# EAGLE design Arduino Advanced Sensor Board (EAGLE 7.5.0)
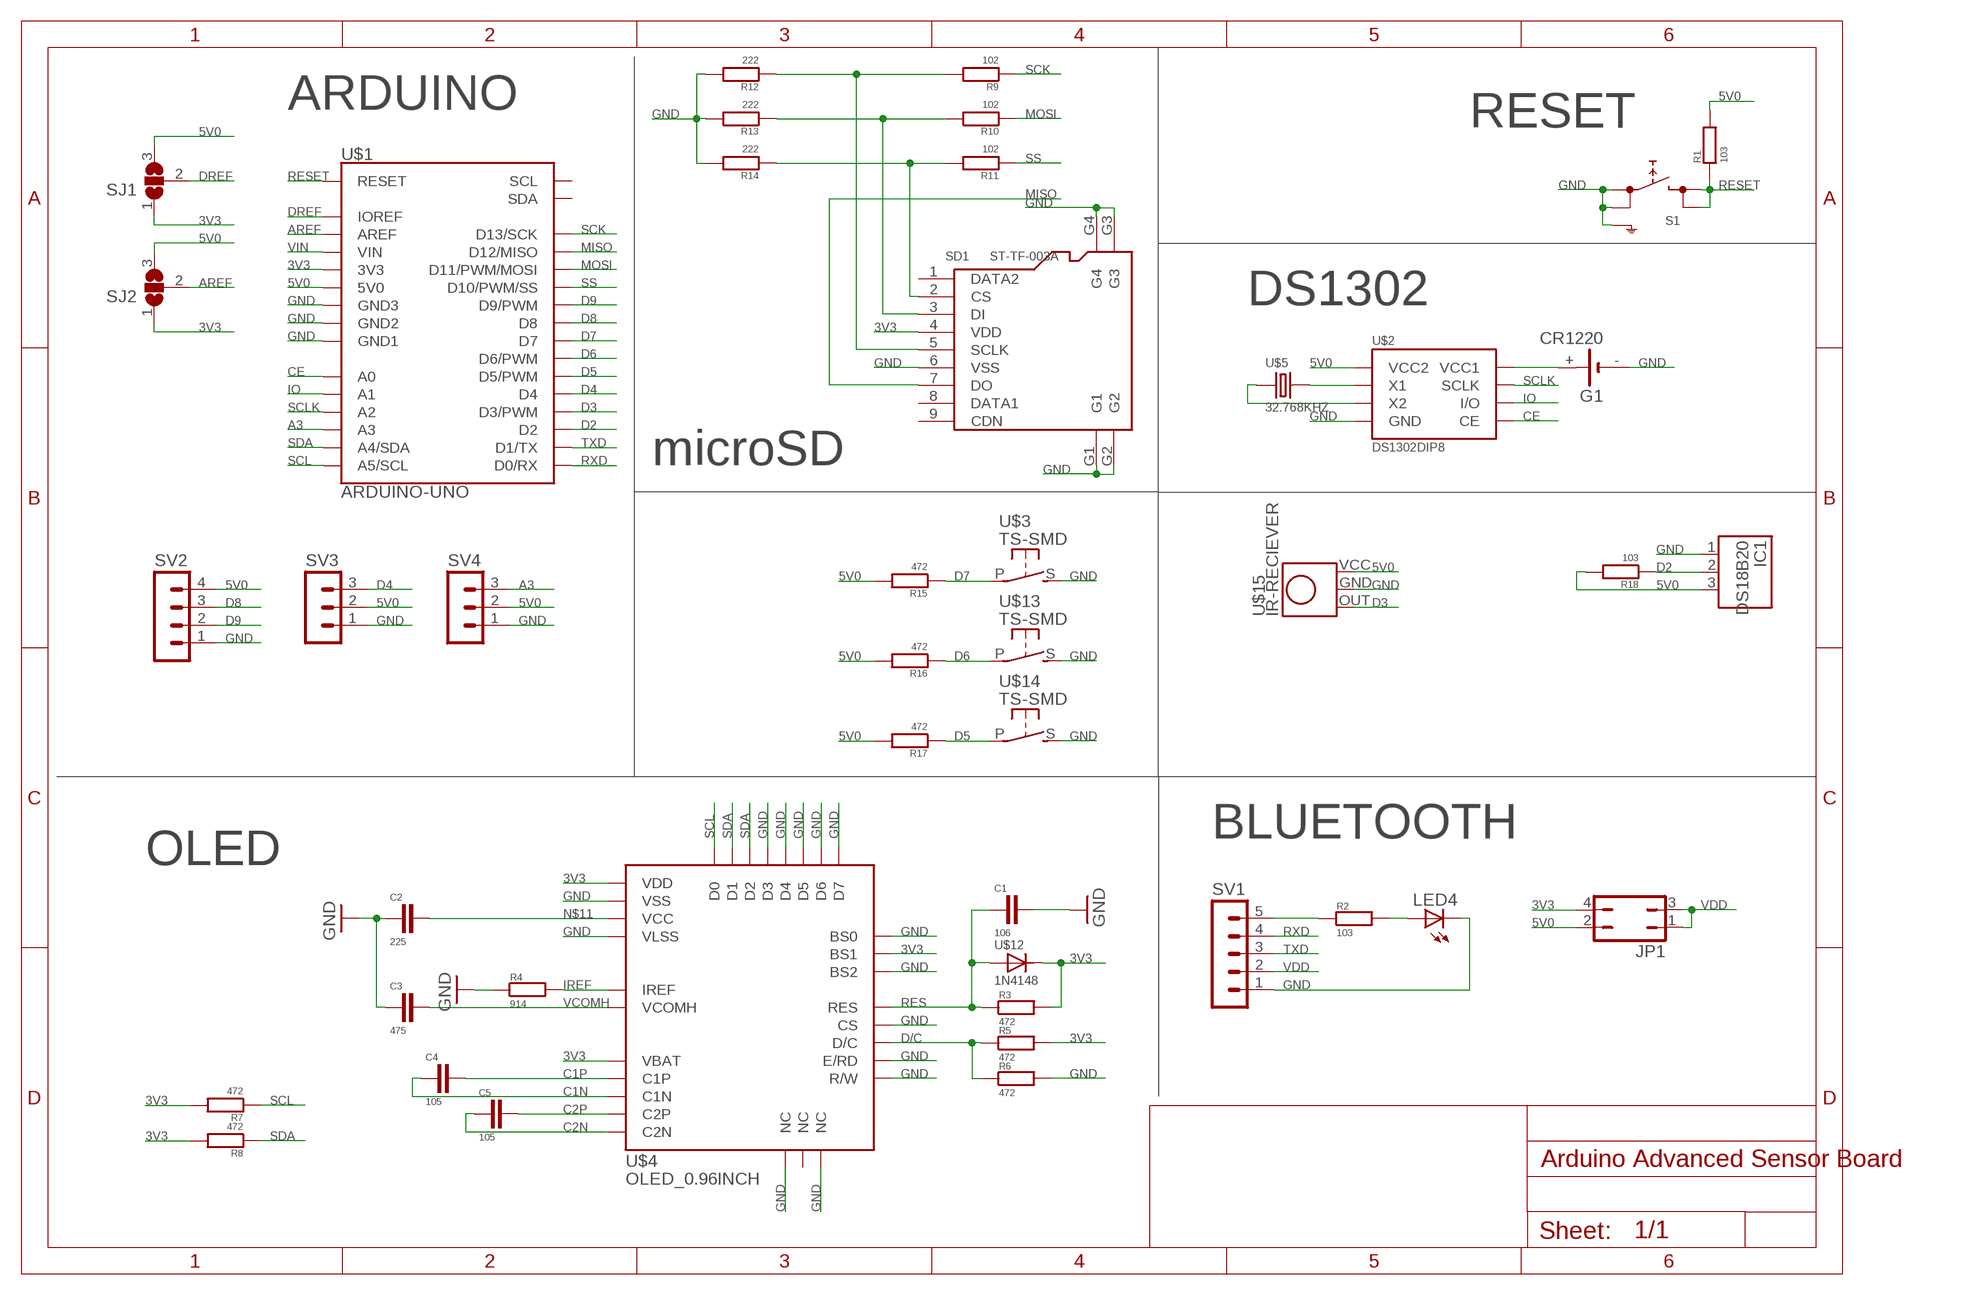
[diagram p0: schematic, sheet 1]

## Parts
C1  106  C0805  [C0805]
C2  225  C0805  [C0805]
C3  475  C0805  [C0805]
C4  105  C0805  [C0805]
C5  105  C0805  [C0805]
G1  CR1220  [CR1220]
IC1  DS18B20  [TO92]
JP1  JP2Q  [JP2Q]
LED4  LEDCHIPLED_0805  [LED0805]
R1  103  R0805  [R0805]
R2  103  R0805  [R0805]
R3  472  R0805  [R0805]
R4  914  R0805  [R0805]
R5  472  R0805  [R0805]
R6  472  R0805  [R0805]
R7  472  R0805  [R0805]
R8  472  R0805  [R0805]
R9  102  R0805  [R0805]
R10  102  R0805  [R0805]
R11  102  R0805  [R0805]
R12  222  R0805  [R0805]
R13  222  R0805  [R0805]
R14  222  R0805  [R0805]
R15  472  R0805  [R0805]
R16  472  R0805  [R0805]
R17  472  R0805  [R0805]
R18  103  R0805  [R0805]
S1  TS-SMD_6S6_SHIELD  [TS-SMD_6*6_SHIELD]
SD1  ST-TF-003A  MICRO-SD-SMD-9+4  [MICRO-SD-SMD-9+4]
SJ1  SJ2W  [SJ_2]
SJ2  SJ2W  [SJ_2]
SV1  MA05-1  [MA05-1]
SV2  MA04-1  [MA04-1]
SV3  MA03-1  [MA03-1]
SV4  MA03-1  [MA03-1]
U$1  ARDUINO-UNO  [ARDUINO-UNO]
U$2  DS1302DIP8  [DIP8]
U$3  TS-SMD  [TS-SMD]
U$4  OLED_0.96INCH  [OLED_0.96INCH]
U$5  32.768KHZ  [32.768KHZ]
U$12  1N4148  [SOD123]
U$13  TS-SMD  [TS-SMD]
U$14  TS-SMD  [TS-SMD]
U$15  IR-RECIEVER  [IR-RECIEVER]

## Nets
3V3: JP1.4 R3.2 R5.2 R7.2 R8.2 SD1.4(VDD) SJ1.1 SJ2.1 U$1.3V3 U$4.6(VBAT) U$4.9(VDD) U$4.11(BS1) U$12.1
5V0: IC1.3(VCC) JP1.2 R1.2 R15.2 R16.2 R17.2 R18.2 SJ1.3 SJ2.3 SV2.4 SV3.2 SV4.2 U$1.5V0 U$2.1(VCC2) U$15.VCC
A3: SV4.3 U$1.A3
AREF: SJ2.2 U$1.AREF
C1N: C4.2 U$4.5(C1N)
C1P: C4.1 U$4.4(C1P)
C2N: C5.2 U$4.3(C2N)
C2P: C5.1 U$4.2(C2P)
CE: U$1.A0 U$2.5(CE)
D2: IC1.2(DQ) R18.1 U$1.D2
D3: U$1.D3(D3/PWM) U$15.OUT
D4: SV3.3 U$1.D4
D5: R17.1 U$1.D5(D5/PWM) U$14.P
D6: R16.1 U$1.D6(D6/PWM) U$13.P
D7: R15.1 U$1.D7 U$3.P
D8: SV2.3 U$1.D8
D9: SV2.2 U$1.D9(D9/PWM)
D/C: R5.1 R6.1 U$4.15(D/C)
DREF: SJ1.2 U$1.REF(IOREF)
GND: C1.1 C2.2 C3.2 G1.- IC1.1(GND) LED4.C R4.1 R6.2 R12.2 R13.2 R14.2 S1.1(1.1) S1.2(1.2) S1.5(SH) SD1.6(VSS) SD1.G1 SD1.G2 SD1.G3 SD1.G4 SV1.1 SV2.1 SV3.1 SV4.1 U$1.GND1 U$1.GND2 U$1.GND3 U$2.4(GND) U$3.S U$4.1(NC) U$4.8(VSS) U$4.10(BS0) U$4.12(BS2) U$4.13(CS) U$4.16(R/W) U$4.17(E/RD) U$4.21(D3) U$4.22(D4) U$4.23(D5) U$4.24(D6) U$4.25(D7) U$4.29(VLSS) U$4.30(NC) U$13.S U$14.S U$15.GND
IO: U$1.A1 U$2.6(I/O)
IREF: R4.2 U$4.26(IREF)
MISO: SD1.7(DO) U$1.D12(D12/MISO)
MOSI: R10.1 U$1.D11(D11/PWM/MOSI)
N$4: U$2.2(X1) U$5.P$2
N$5: U$2.3(X2) U$5.P$1
N$6: G1.+ U$2.8(VCC1)
N$7: R2.1 SV1.5
N$8: LED4.A R2.2
N$9: R11.2 R14.1 SD1.2(CS)
N$10: R10.2 R13.1 SD1.3(DI)
N$11: C2.1 U$4.28(VCC)
N$12: R9.2 R12.1 SD1.5(SCLK)
RES: C1.2 R3.1 U$4.14(RES) U$12.2
RESET: R1.1 S1.3(2.1) S1.4(2.2) U$1.RST(RESET)
RXD: SV1.4 U$1.D0(D0/RX)
SCK: R9.1 U$1.D13(D13/SCK)
SCL: R7.1 U$1.A5(A5/SCL) U$4.18(D0)
SCLK: U$1.A2 U$2.7(SCLK)
SDA: R8.1 U$1.A4(A4/SDA) U$4.19(D1) U$4.20(D2)
SS: R11.1 U$1.D10(D10/PWM/SS)
TXD: SV1.3 U$1.D1(D1/TX)
VCOMH: C3.1 U$4.27(VCOMH)
VDD: JP1.1 JP1.3 SV1.2
VIN: U$1.VIN
Unconnected: SD1.1(DATA2) SD1.8(DATA1) SD1.9(CDN) U$1.SCL U$1.SDA U$4.7(NC)

## Notes on the sheet
- ARDUINO
- RESET
- DS1302
- microSD
- BLUETOOTH
- OLED

## Library data of the parts
C1-C5 = RCLDA:C: CAPACITOR
G1 = Power:CR1220: Battery Holder, SMT, 12mm multicomp PART NO. CH291-1220LF Source: Data sheet <http://www.farnell.com/datasheets/1505860.pdf>
IC1 = Senser:DS18B20: Programmable Resolution Digital Thermometer This chip provides a onewire thermosensor with approx. 0.5°C accuracy. A programmable over/undertemperure alarm is available. The precision can be set from 9..12 bits. Notes: Vdd must be applied for accurate measurements at low temperatures, as the parasite power circuit otherwise heats the sensor. If parasite power is used, Vdd has to be connected to GND. The DS1822 is a low-cost thermometer chip, the DS18S20 is similar to the DS18B20, but with 9 Bit precision only. Author: Jan Kandziora <jjj@gmx.de>
JP1 = Jumper:JP2Q: JUMPER
LED4 = Display:LED
R1-R18 = RCLDA:R: RESISTOR
S1 = Button:TS-SMD_6*6_SHIELD: 6.2 X 6.5mm TACT Switch (SMD) Source: http://www3.alps.co.jp/WebObjects/catalog.woa/PDF/E/Switch/Tact/SKHM/SKHM.PDF
SD1 = Socket:MICRO-SD-SMD-9+4: 320090000; MPN: ST-TF-003A
SJ1 SJ2 = Jumper:SJ2W: SMD solder JUMPER
SV1 = Pin-Header:MA05-1: PIN HEADER; OC_FARNELL: unknown; OC_NEWARK: unknown
SV2 = Pin-Header:MA04-1: PIN HEADER; OC_FARNELL: unknown; OC_NEWARK: unknown
SV3 SV4 = Pin-Header:MA03-1: PIN HEADER; OC_FARNELL: unknown; OC_NEWARK: unknown
U$1 = Module:ARDUINO-UNO
U$2 = Chip:DS1302
U$3 U$13 U$14 = Button:TS-SMD
U$4 = Display:OLED_0.96INCH
U$5 = Crystal:32.768KHZ
U$12 = RCLDA:1N4148
U$15 = Senser:IR-RECIEVER

## Board
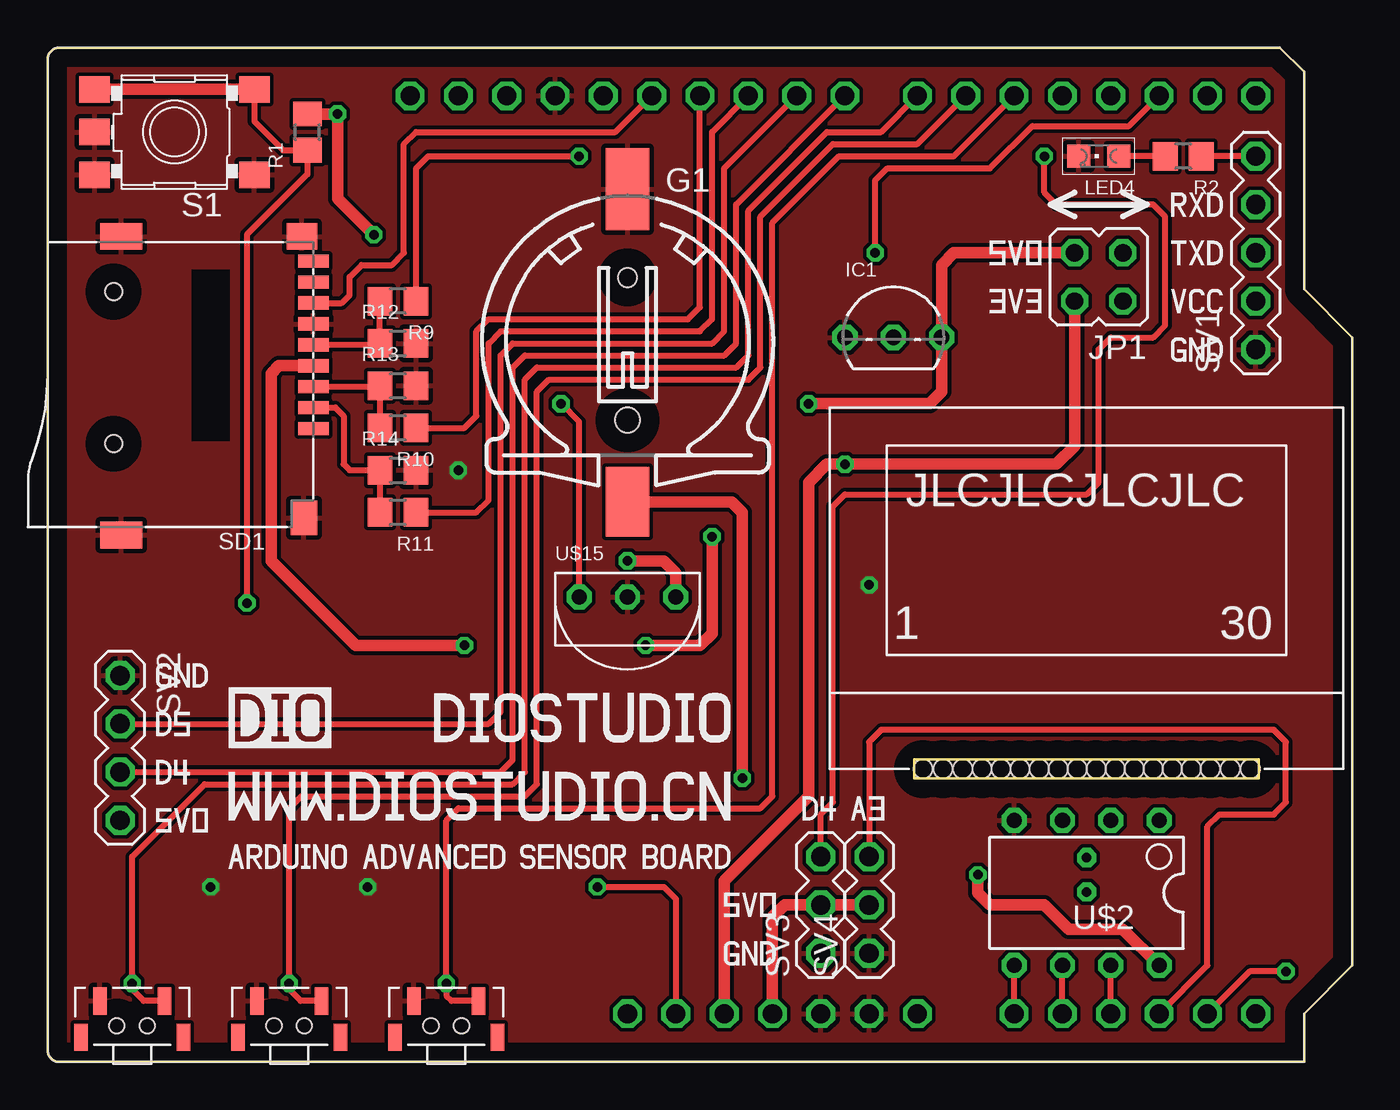
[diagram p1: board, top side]
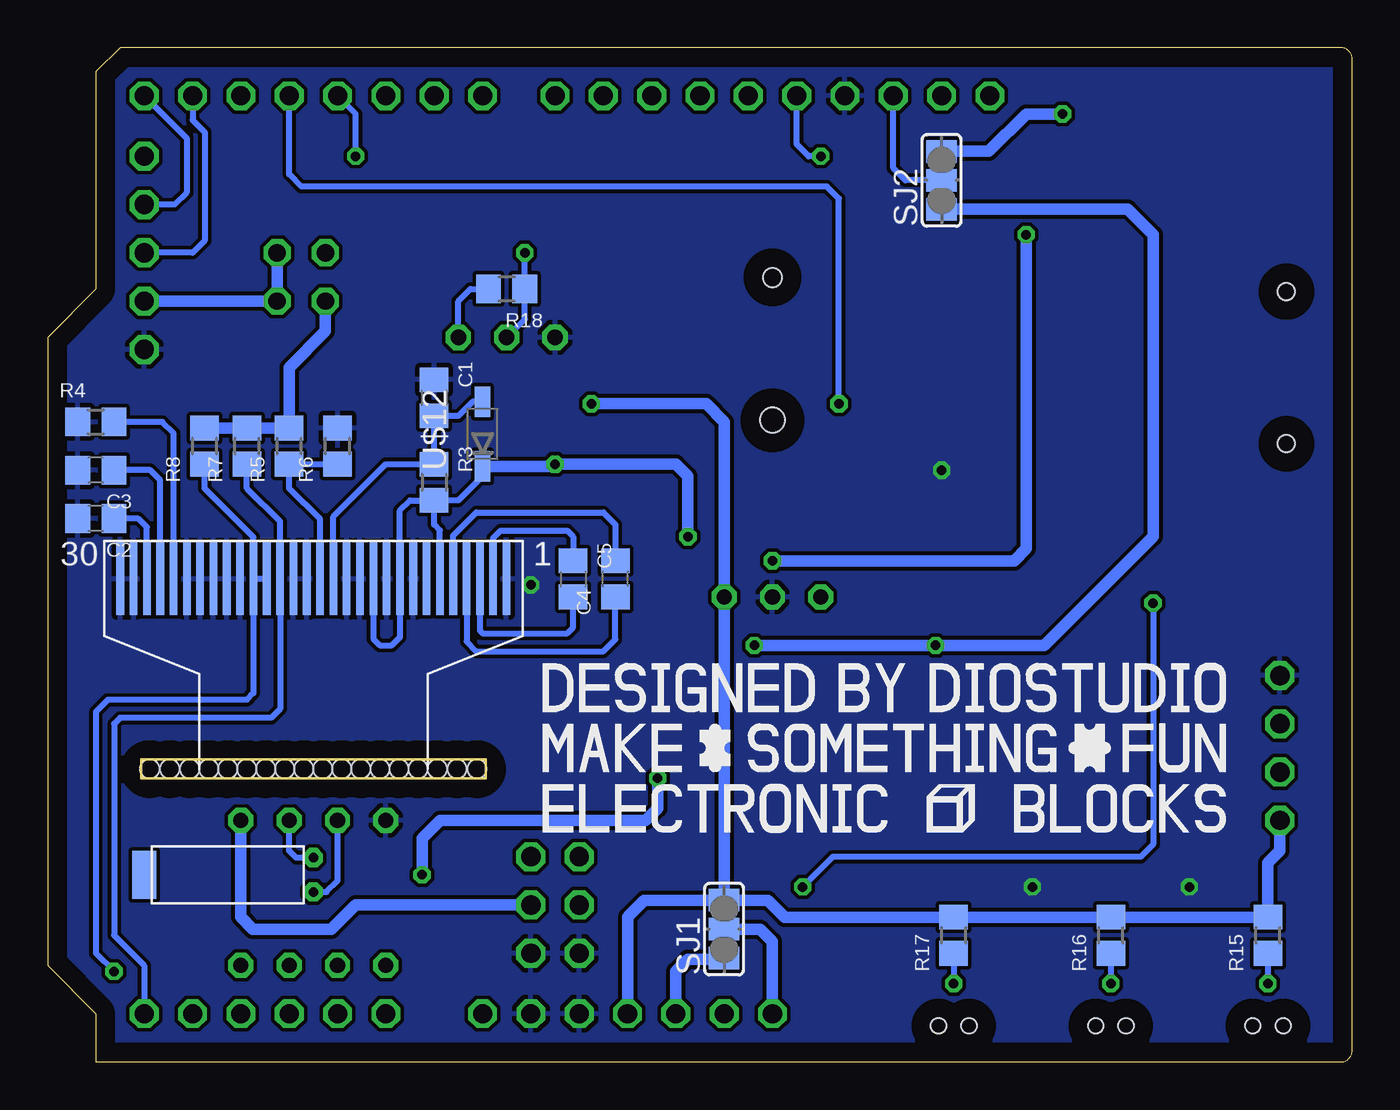
[diagram p2: board, bottom side, seen from below]

Size 68.58 x 53.34 mm. Coordinates in mm from the lower left corner, seen from the top.
Outline: 0,0.64 0,52.7 arc-90 0.64,53.34 64.77,53.34 66.04,52.07 66.04,40.64 68.58,38.1 68.58,5.08 66.04,2.54 66.04,0 0.64,0 arc-90 0,0.64
Copper layers (1*16): Top 0.035mm / dielectric 1.5mm / Bottom 0.035mm
Design rules "default": minimum track width 10mil, minimum drill 24mil, track to track 8mil, track to pad 8mil, pad to pad 8mil, via to via 8mil, smd to smd 8mil, copper to edge 40mil, drill to drill 8mil, minimum pad ring 10mil, minimum via ring 8mil, stop-mask expansion 4mil, vias tented up to drill 0mil, thermal gap 10mil

### Footprints (pad centres in the part's own frame; a part is rotated, then mirrored left to right if it is on the bottom)
C0805 = smd 1.3 x 1.5: 1 -0.95,0; 2 0.95,0
CR1220 = smd 2.3 x 3.66: + 0,-2.296 | smd 2.3 x 4.3: - 0,14.146 | hole 1.3: 0,2 | hole 1: 0,9.5
TO92 = drill 0.813 octagon: 1 -2.54,0; 2 0,0; 3 2.54,0
JP2Q = drill 0.914 octagon: 1 -1.27,-1.27; 2 1.27,-1.27; 3 -1.27,1.27; 4 1.27,1.27
LED0805 = smd 1.2 x 1.2: A -1.05,0; C 1.05,0
R0805 = smd 1.3 x 1.5: 1 -0.95,0; 2 0.95,0
TS-SMD_6*6_SHIELD = smd 1.6 x 1.4: 1 -4.2,2.25; 2 4.2,2.25; 3 -4.2,-2.25; 4 4.2,-2.25; 5 4.2,0
MICRO-SD-SMD-9+4 = smd 1.6 x 0.7: 1 0,2.25; 2 0,1.15; 3 0,0.05; 4 0,-1.05; 5 0,-2.15; 6 0,-3.25; 7 0,-4.35; 8 0,-5.45; 9 0,-6.55 | smd 1.6 x 1.4: G1 0.6,-7.85 | smd 2.2 x 1.4: G2 10.1,-7.85; G3 10.1,7.85 | smd 1.4 x 1.8: G4 0.5,6.95 | hole 0.9: 10.5,-4.95; 10.5,3.05
SJ_2 = smd 1.168 x 1.6: 1 -1.524,0; 2 0,0; 3 1.524,0
MA05-1 = drill 1.016 octagon: 1 -5.08,0; 2 -2.54,0; 3 0,0; 4 2.54,0; 5 5.08,0
MA04-1 = drill 1.016 octagon: 1 -3.81,0; 2 -1.27,0; 3 1.27,0; 4 3.81,0
MA03-1 = drill 1.016 octagon: 1 -2.54,0; 2 0,0; 3 2.54,0
ARDUINO-UNO = drill 1 octagon: 3V3 35.56,2.54; 5V0 38.1,2.54; A0 50.8,2.54; A1 53.34,2.54; A2 55.88,2.54; A3 58.42,2.54; A4 60.96,2.54; A5 63.5,2.54; AREF 24.13,50.8; D0 63.5,50.8; D1 60.96,50.8; D2 58.42,50.8; D3 55.88,50.8; D4 53.34,50.8; D5 50.8,50.8; D6 48.26,50.8; D7 45.72,50.8; D8 41.91,50.8; D9 39.37,50.8; D10 36.83,50.8; D11 34.29,50.8; D12 31.75,50.8; D13 29.21,50.8; GND1 26.67,50.8; GND2 43.18,2.54; GND3 40.64,2.54; REF 30.48,2.54; RST 33.02,2.54; SCL 19.05,50.8; SDA 21.59,50.8; VIN 45.72,2.54
DIP8 = drill 0.8 octagon: 1 -3.81,-3.81; 2 -1.27,-3.81; 3 1.27,-3.81; 4 3.81,-3.81; 5 3.81,3.81; 6 1.27,3.81; 7 -1.27,3.81; 8 -3.81,3.81
TS-SMD = smd 0.711 x 1.422: P -1.7,-1.3; P$1 2.7,0.6; P$4 -2.7,0.6; S 1.7,-1.3 | hole 0.8: 0.8,0; -0.8,0
OLED_0.96INCH = smd 0.4 x 3.81 bottom: 1 -10.15,0; 2 -9.45,0; 3 -8.75,0; 4 -8.05,0; 5 -7.35,0; 6 -6.65,0; 7 -5.95,0; 8 -5.25,0; 9 -4.55,0; 10 -3.85,0; 11 -3.15,0; 12 -2.45,0; 13 -1.75,0; 14 -1.05,0; 15 -0.35,0; 16 0.35,0; 17 1.05,0; 18 1.75,0; 19 2.45,0; 20 3.15,0; 21 3.85,0; 22 4.55,0; 23 5.25,0; 24 5.95,0; 25 6.65,0; 26 7.35,0; 27 8.05,0; 28 8.75,0; 29 9.45,0; 30 10.15,0 | hole 1: -5.5,-10; 5.5,-10; -6.5,-10; -4.5,-10; -3.5,-10; -2.5,-10; -1.5,-10; -0.5,-10; 0.5,-10; 1.5,-10; 2.5,-10; 3.5,-10; 4.5,-10; 6.5,-10; -7.55,-10; 7.55,-10; 8.6,-10; -8.6,-10
32.768KHZ = drill 0.5 octagon: P$1 -0.9,0; P$2 0.9,0 | smd 2.54 x 1.27: P$3 0,8.89
SOD123 = smd 1.6 x 0.8: 1 -1.7,0; 2 1.7,0
IR-RECIEVER = drill 0.8 octagon: GND 0,0; OUT -2.54,0; VCC 2.54,0

### Placement (x,y rotation side)
C1  48.26,34.92 270 bottom
C2  66.04,28.57 180 bottom
C3  66.04,31.11 180 bottom
C4  38.73,25.4 90 bottom
C5  40.96,25.4 270 bottom
G1  30.48,31.75 0 top
IC1  44.45,38.1 0 top
JP1  55.24,41.27 180 top
LED4  55.24,47.62 180 top
R1  13.65,48.9 90 top
R2  59.69,47.62 180 top
R3  48.26,30.48 270 bottom
R4  66.04,33.66 0 bottom
R5  55.88,32.38 90 bottom
R6  53.34,32.38 90 bottom
R7  58.1,32.38 90 bottom
R8  60.33,32.38 90 bottom
R9  18.41,40.01 180 top
R10  18.41,33.34 180 top
R11  18.41,28.89 180 top
R12  18.41,37.78 0 top
R13  18.41,35.56 0 top
R14  18.41,31.11 0 top
R15  4.45,6.67 90 bottom
R16  12.7,6.67 90 bottom
R17  20.95,6.67 90 bottom
R18  44.45,40.64 180 bottom
S1  6.67,48.9 180 top
SD1  13.97,35.56 180 top
SJ1  33.02,6.99 90 bottom
SJ2  21.59,46.35 90 bottom
SV1  63.5,42.55 90 top
SV2  3.81,16.51 270 top
SV3  40.64,8.26 90 top
SV4  43.18,8.26 90 top
U$1  0,0 0 top
U$2  54.61,8.89 180 top
U$3  4.45,1.91 180 top
U$4  54.61,25.4 0 top
U$5  54.61,9.84 90 bottom
U$6  [5V0_050]  49.53,41.91 0 top
U$7  [3V3_050]  49.53,39.37 0 top
U$8  [GND_050]  59.05,36.83 0 top
U$9  [RXD_050]  59.05,44.45 0 top
U$10  [TXD_050]  59.05,41.91 0 top
U$11  [VCC_050]  59.05,39.37 0 top
U$12  45.72,33.02 90 bottom
U$13  12.7,1.91 180 top
U$14  20.95,1.91 180 top
U$15  30.48,24.45 0 top
U$16  [ARDUINO_ADVANCED_SENSOR_BOARD]  9.53,10.16 0 top
U$17  [MAKE_SOMETHING_FUN_100]  42.55,12.06 0 bottom
U$18  [LOGO_100]  9.53,16.51 0 top
U$19  [DIOSTUDIO_100]  20.32,16.83 0 top
U$20  [WWW.DIOSTUDIO.CN_100]  9.53,12.7 0 top
U$21  [5V0_050]  35.56,7.62 0 top
U$22  [GND_050]  35.56,5.08 0 top
U$23  [D4_050]  39.69,12.7 0 top
U$24  [A3_050]  42.23,12.7 0 top
U$25  [GND_050]  5.71,19.68 0 top
U$26  [5V0_050]  5.71,12.06 0 top
U$27  [D5_050]  5.71,17.14 0 top
U$28  [D4_050]  5.71,14.61 0 top

### Tracks (layer width: path | path; a pad name or v marks a point on that pad's centre or on a via)
3V3  (via drill 0.5)
  Top 0.61: U$1.3V3 35.56,9.53 40.01,13.97 40.01,30.48 40.96,31.43 v41.91,31.43 53.02,31.43 53.98,32.38 JP1.4 | SD1.4 12.16,36.61 11.75,36.2 11.75,26.35 16.19,21.91 v21.91,21.91 | v31.43,21.91 34.29,21.91 34.92,22.54 v34.92,27.62
  Bottom 0.305: 33.08,5.4 SJ1.1 | U$12.1 45.72,30.8 46.99,29.53 R3.2 | U$4.6 47.96,27.96 48.26,28.26 R3.2 | U$4.11 51.46,22.25 51.12,21.91 50.48,21.91 50.06,22.33 U$4.9 50.06,29 49.53,29.53 R3.2
  Bottom 0.61: R8.2 R7.2 R5.2 55.88,36.51 53.98,38.42 JP1.4 | 33.08,5.4 34.92,5.4 35.56,4.76 U$1.3V3 | U$12.1 42.02,31.32 v41.91,31.43 35.56,31.43 34.92,30.8 v34.92,27.62 | v31.43,21.91 v21.91,21.91 16.19,21.91 10.48,27.62 10.48,43.5 11.81,44.83 SJ2.1
5V0  (via drill 0.5)
  Top 0.61: U$1.5V0 38.1,7.62 38.73,8.26 SV3.2 SV4.2 | R1.2 v15.24,49.84 v15.24,49.85 15.24,45.4 v17.14,43.5 | JP1.2 47.62,42.55 46.99,41.91 IC1.3 46.99,35.24 46.35,34.61 v40.01,34.61 | v30.48,26.35 32.38,26.35 33.02,25.72 U$15.VCC
  Bottom 0.305: IC1.3 46.99,40.01 46.35,40.64 R18.2
  Bottom 0.61: SV4.2 52.39,8.26 53.66,6.99 57.78,6.99 58.42,7.62 U$2.1 | SV2.4 3.81,11.11 4.45,10.48 R15.2 R16.2 R17.2 29.84,7.62 30.73,8.51 SJ1.3 | SJ1.3 37.21,8.51 38.1,7.62 U$1.5V0 | SJ1.3 U$15.VCC 33.02,33.66 33.97,34.61 v40.01,34.61 | SJ2.3 19.11,47.88 17.14,49.85 v15.24,49.85 | v17.14,43.5 17.14,26.99 17.78,26.35 v30.48,26.35
A3
  Top 0.305: U$1.A3 60.96,5.08 60.96,12.38 61.59,13.02 64.45,13.02 65.09,13.65 65.09,16.83 64.45,17.46 43.81,17.46 43.18,16.83 SV4.3
AREF
  Bottom 0.305: SJ2.2 23.5,46.35 24.13,46.99 U$1.AREF
C1N
  Bottom 0.305: U$4.5 47.26,27.67 46.04,28.89 39.37,28.89 38.73,28.26 C4.2
C1P
  Bottom 0.305: U$4.4 46.56,22.11 46.04,21.59 39.37,21.59 38.73,22.23 C4.1
C2N
  Bottom 0.305: U$4.3 45.86,22.68 45.72,22.54 41.27,22.54 40.96,22.86 C5.2
C2P
  Bottom 0.305: U$4.2 45.16,27.55 44.77,27.94 41.27,27.94 40.96,27.62 C5.1
CE
  Top 0.305: U$1.A0 U$2.5
D2  (via drill 0.5)
  Top 0.305: v43.5,42.55 43.5,46.35 44.13,46.99 49.53,46.99 51.75,49.21 56.83,49.21 U$1.D2
  Bottom 0.305: IC1.2 43.5,39.05 R18.1 43.5,42.23 v43.5,42.55
D3  (via drill 0.5)
  Top 0.305: U$15.OUT 27.94,33.66 v26.99,34.61
  Bottom 0.305: v26.99,34.61 26.99,45.4 27.62,46.04 55.24,46.04 55.88,46.67 U$1.D3
D4  (via drill 0.5)
  Top 0.305: SV3.3 40.64,13.02 41.27,13.65 41.27,29.21 41.91,29.84 54.61,29.84 55.24,30.48 55.24,37.47 55.88,38.1 58.1,38.1 58.74,38.73 58.74,44.45 58.1,45.09 53.02,45.09 52.39,45.72 v52.39,47.62
  Bottom 0.305: v52.39,47.62 52.39,49.85 U$1.D4
D5  (via drill 0.5)
  Top 0.305: U$14.P 21.24,3.21 20.95,3.49 v20.95,4.13 20.95,12.7 21.59,13.34 37.47,13.34 38.1,13.97 38.1,44.13 41.59,47.62 47.62,47.62 U$1.D5
  Bottom 0.305: R17.1 v20.95,4.13
D6  (via drill 0.5)
  Top 0.305: U$13.P 13.3,3.21 12.7,3.81 v12.7,4.13 12.7,13.34 13.34,13.97 25.08,13.97 25.72,14.61 25.72,35.24 26.35,35.88 36.83,35.88 37.47,36.51 37.47,44.45 41.27,48.26 45.72,48.26 U$1.D6
  Bottom 0.305: R16.1 v12.7,4.13
D7  (via drill 0.5)
  Top 0.305: U$3.P 5.05,3.21 4.45,3.81 v4.45,4.13 4.45,10.79 8.26,14.61 24.45,14.61 25.08,15.24 25.08,35.88 25.72,36.51 36.2,36.51 36.83,37.15 36.83,44.77 40.96,48.9 43.81,48.9 U$1.D7
  Bottom 0.305: R15.1 v4.45,4.13
D8
  Top 0.305: SV2.3 23.81,15.24 24.45,15.88 24.45,36.51 25.08,37.15 35.56,37.15 36.2,37.78 36.2,45.09 U$1.D8
D9
  Top 0.305: SV2.2 23.18,17.78 23.81,18.41 23.81,37.15 24.45,37.78 34.92,37.78 35.56,38.42 35.56,46.99 U$1.D9
D/C
  Bottom 0.305: U$4.15 54.26,28.54 55.88,30.16 R5.1 R6.1
DREF
  Bottom 0.61: U$1.REF 30.48,6.35 31.11,6.99 SJ1.2
GND  (via drill 0.5)
  other vias: 21.59,31.11 8.57,9.21 16.83,9.21 43.18,25.08
  pour Top: 0,0 0,53.34 64.77,53.34 66.04,52.07 66.04,40.64 68.58,38.1 68.58,5.08 66.04,2.54 66.04,0
  pour Bottom: 0,0 0,53.34 64.77,53.34 66.04,52.07 66.04,40.64 68.58,38.1 68.58,5.08 66.04,2.54 66.04,0
IO
  Top 0.305: U$1.A1 U$2.6
IREF
  Bottom 0.305: U$4.26 61.96,33.07 62.55,33.66 R4.2
MISO
  Top 0.305: SD1.7 15.46,39.91 15.88,40.32 15.88,41.27 16.51,41.91 18.1,41.91 18.73,42.55 18.73,48.26 19.37,48.9 29.84,48.9 U$1.D12
MOSI
  Top 0.305: R10.1 21.91,33.34 22.54,33.97 22.54,38.42 23.18,39.05 33.66,39.05 34.29,39.69 U$1.D11
N$4
  Bottom 0.305: U$5.P$2 55.51,10.74 55.88,11.11 U$2.2
N$5
  Bottom 0.305: U$5.P$1 53.92,8.94 53.34,9.53 U$2.3
N$6  (via drill 0.5)
  Top 0.61: G1.+ 35.95,29.45 36.51,28.89 v36.51,14.92 | v48.9,9.84 48.9,8.89 49.53,8.26 52.39,8.26 53.66,6.99 56.52,6.99 U$2.8
  Bottom 0.61: v36.51,14.92 36.51,13.34 37.15,12.7 47.94,12.7 48.9,11.75 v48.9,9.84
N$7
  Top 0.305: SV1.5 R2.1
N$8
  Top 0.305: R2.2 LED4.A
N$9
  Top 0.305: SD1.2 15.12,34.41 15.56,33.97 15.56,31.43 15.88,31.11 R14.1 R11.2
N$10
  Top 0.305: SD1.3 17.41,35.51 R13.1 R10.2
N$11
  Bottom 0.305: U$4.28 63.36,28.12 63.82,28.57 C2.1
N$12
  Top 0.305: SD1.5 17.39,37.71 R12.1 R9.2
RES
  Bottom 0.305: U$12.2 46.24,34.72 46.99,33.97 C1.2 R3.1 50.8,31.43 53.56,28.67 U$4.14
RESET  (via drill 0.5)
  Top 0.305: S1.3 10.87,49.46 12.38,47.94 R1.1 13.65,46.67 10.48,43.5 v10.48,24.13 | v28.89,9.21 32.38,9.21 33.02,8.57 U$1.RST
  Top 0.61: S1.4 S1.3
  Bottom 0.305: v10.48,24.13 10.48,11.43 11.11,10.79 27.3,10.79 v28.89,9.21
RXD
  Bottom 0.305: U$1.D0 61.28,48.58 61.28,45.72 61.91,45.09 SV1.4
SCK  (via drill 0.5)
  Top 0.305: R9.1 19.36,46.99 20,47.62 v27.94,47.62
  Bottom 0.305: v27.94,47.62 28.57,47.62 29.21,48.26 U$1.D13
SCL
  Bottom 0.305: R7.1 58.1,30.16 56.36,28.42 U$4.18 56.36,18.57 56.83,18.1 64.77,18.1 65.09,17.78 65.09,6.67 63.5,5.08 U$1.A5
SCLK
  Top 0.305: U$1.A2 U$2.7
SDA  (via drill 0.5)
  Top 0.305: v65.09,4.76 63.18,4.76 U$1.A4
  Bottom 0.305: U$4.19 U$4.20 | U$4.20 57.76,27.6 60.33,30.16 R8.1 | U$4.20 57.76,19.39 58.1,19.05 65.41,19.05 66.04,18.41 66.04,5.71 v65.09,4.76
SS
  Top 0.305: R11.1 22.54,28.89 23.18,29.53 23.18,37.78 23.81,38.42 34.29,38.42 34.92,39.05 34.92,48.9 U$1.D10
TXD
  Bottom 0.305: U$1.D1 60.96,49.53 60.33,48.9 60.33,43.18 60.96,42.55 SV1.3
VCOMH
  Bottom 0.305: U$4.27 62.66,30.59 63.18,31.11 C3.1
VDD
  Bottom 0.61: JP1.1 JP1.3 SV1.2

### Text on the board
tPlace: JLCJLCJLCJLC | 1 | 30